# EAGLE design HD_RF_korsel_2010_10_26 (EAGLE 5.04)
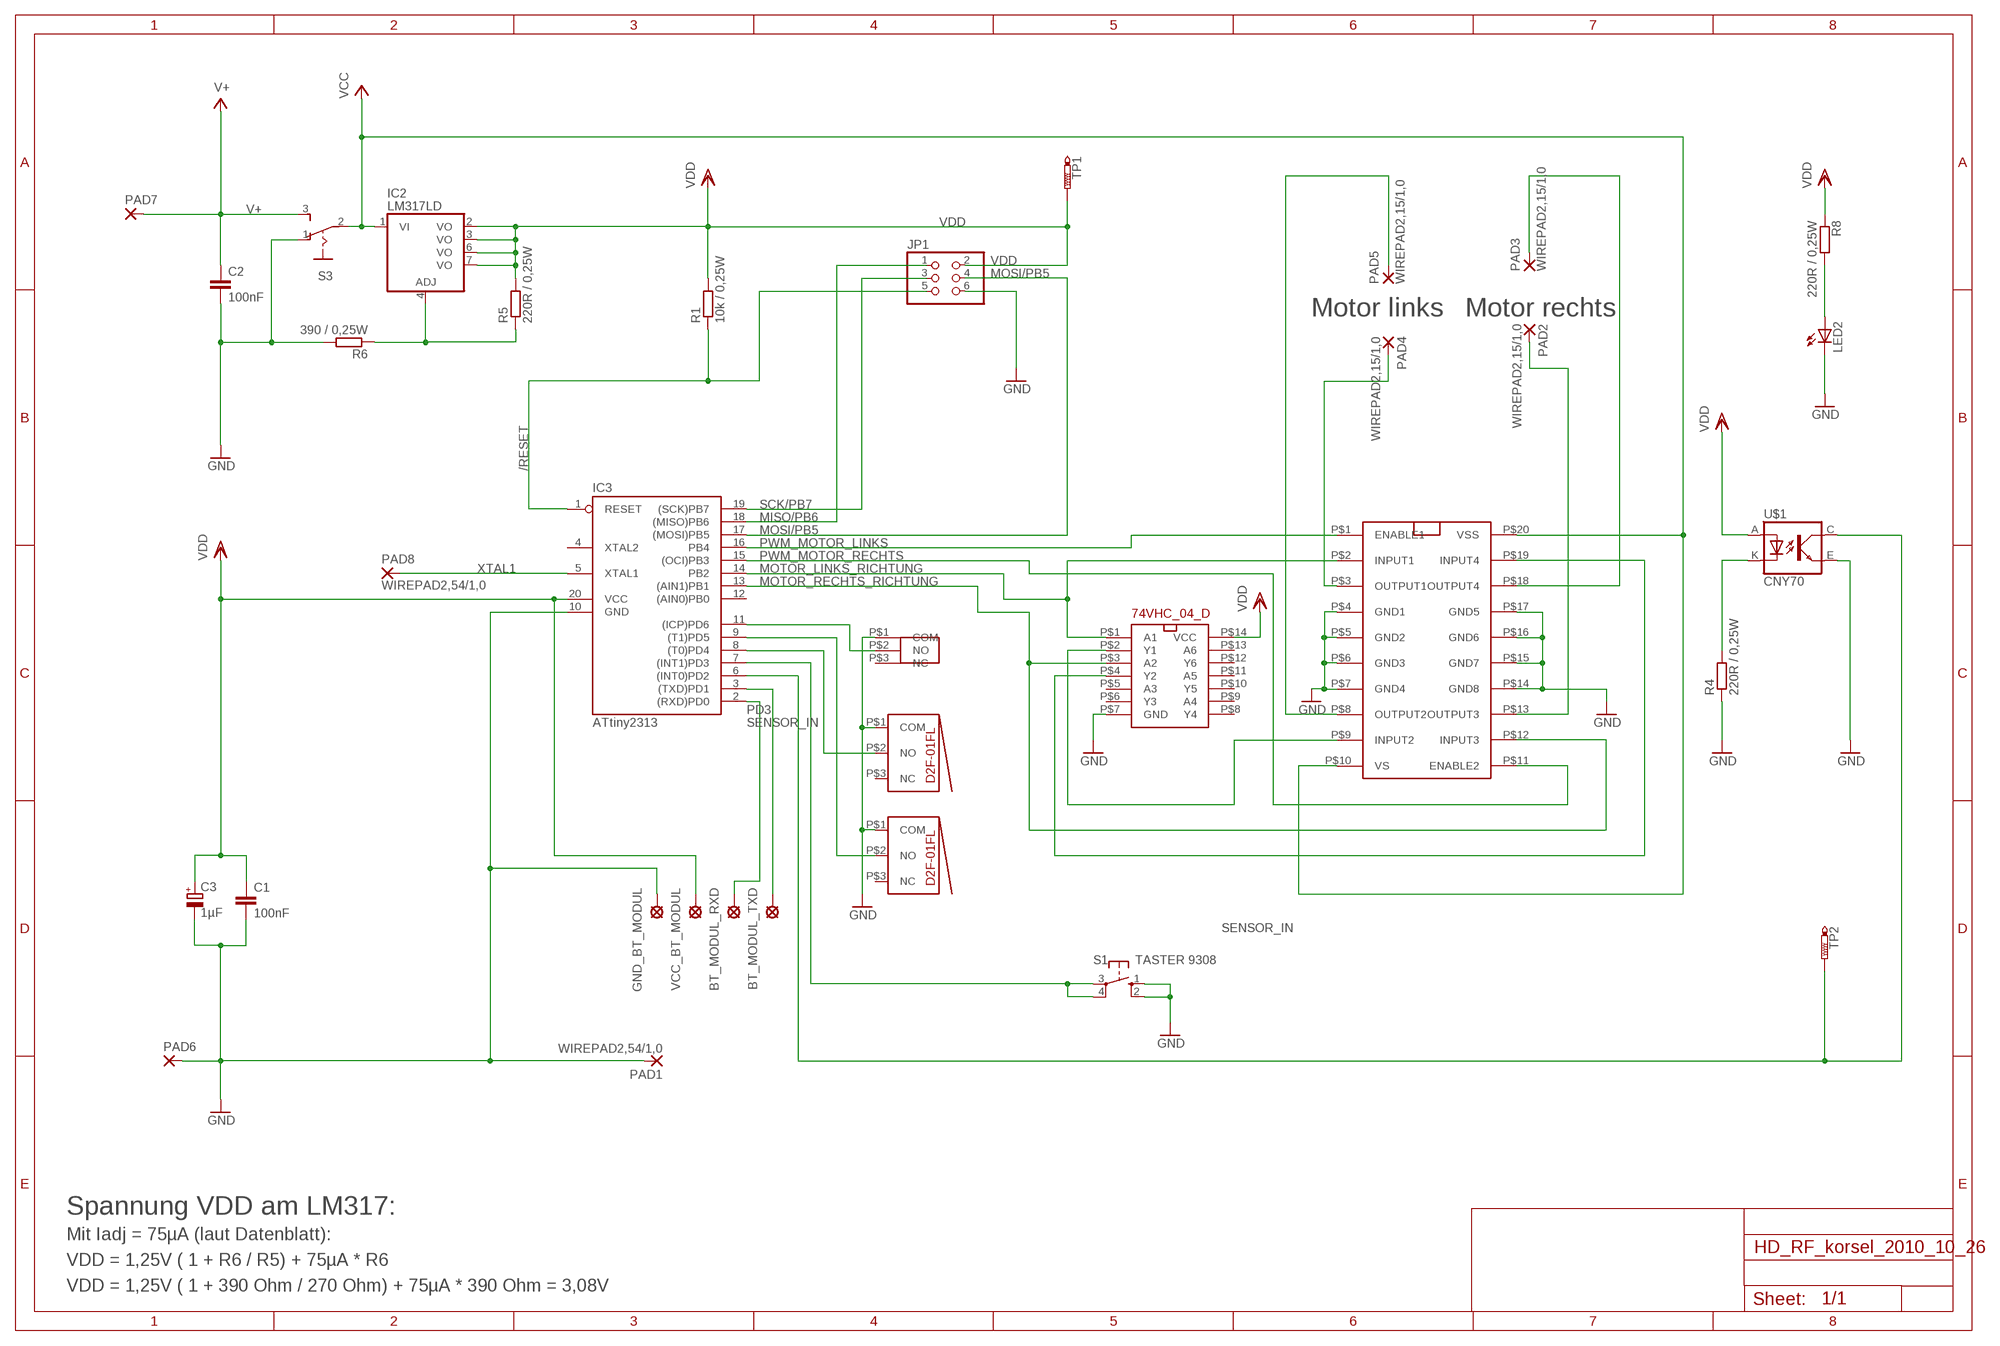
[diagram p0: schematic, sheet 1]

## Parts
BT_MODUL_RXD  LSP10  [LSP10]
BT_MODUL_TXD  LSP10  [LSP10]
C1  100nF  C-EUC1206  [C1206]
C2  100nF  C-EUC1206  [C1206]
C3  1µF  CPOL-EUSMCB  [SMC_B]
FRONT_SWITCH  DF-01FL_STEHEND  [DF-01FL_STEHEND]
GND_BT_MODUL  LSP10  [LSP10]
IC2  LM317LD  [SO08]
IC3  ATtiny2313  AT90S2313S  [SO20L]
JP1  PINHD-2X3  [2X03]
L293DD  L293DD  [L293DD]
LED2  LED3MM  [LED3MM]
LEFT_SWITCH  D2F-01FL  [D2F-01FL]
PAD1  WIREPAD2,54/1,0  [2,54/1,0]
PAD2  WIREPAD2,15/1,0  [2,15/1,0]
PAD3  WIREPAD2,15/1,0  [2,15/1,0]
PAD4  WIREPAD2,15/1,0  [2,15/1,0]
PAD5  WIREPAD2,15/1,0  [2,15/1,0]
PAD6  SMD5  [SMD2,54-5,08]
PAD7  SMD5  [SMD2,54-5,08]
PAD8  WIREPAD2,54/1,0  [2,54/1,0]
R1  10k / 0,25W  R-EU_R1206  [R1206]
R4  220R / 0,25W  R-EU_R1206  [R1206]
R5  220R / 0,25W  R-EU_R1206  [R1206]
R6  390 / 0,25W  R-EU_R1206  [R1206]
R8  220R / 0,25W  R-EU_R1206  [R1206]
RIGHT_SWITCH  D2F-01FL  [D2F-01FL]
S1  TASTER 9308  10-XX  [B3F-10XX]
S3  255SB  [255SB]
TP1  PTR1TP15R  [TP15R]
TP2  PTR1TP15R  [TP15R]
U$1  CNY70  CNY70SMD  [SMD]
U$2  74VHC_04_D  [74VHC_04_D]
VCC_BT_MODUL  LSP10  [LSP10]

## Nets
/RESET: IC3.1(RESET) JP1.5 R1.1
GND: C1.2 C2.2 C3.- FRONT_SWITCH.P$1(COM) GND_BT_MODUL.MP IC3.10(GND) JP1.6 L293DD.P$4(GND1) L293DD.P$5(GND2) L293DD.P$6(GND3) L293DD.P$7(GND4) L293DD.P$14(GND8) L293DD.P$15(GND7) L293DD.P$16(GND6) L293DD.P$17(GND5) LED2.K(C) LEFT_SWITCH.P$1(COM) PAD1.1(P) PAD6.1(P) R4.1 R6.2 RIGHT_SWITCH.P$1(COM) S1.1(S) S1.2(S1) S3.1(O) U$1.E(EMI) U$2.P$7(GND)
MISO/PB6: IC3.18((MISO)PB6) JP1.1
MOSI/PB5: IC3.17((MOSI)PB5) JP1.4
MOTOR_LINKS_RICHTUNG: IC3.14(PB2) L293DD.P$2(INPUT1) U$2.P$1(A1)
MOTOR_RECHTS_RICHTUNG: IC3.13((AIN1)PB1) L293DD.P$12(INPUT3) U$2.P$3(A2)
N$1: LED2.A R8.2
N$2: L293DD.P$3(OUTPUT1) PAD4.1(P)
N$3: R4.2 U$1.K(C)
N$4: L293DD.P$8(OUTPUT2) PAD5.1(P)
N$5: L293DD.P$13(OUTPUT3) PAD2.1(P)
N$6: BT_MODUL_RXD.MP IC3.2((RXD)PD0)
N$7: L293DD.P$18(OUTPUT4) PAD3.1(P)
N$8: BT_MODUL_TXD.MP IC3.3((TXD)PD1)
N$9: IC2.4(ADJ) R5.1 R6.1
N$14: L293DD.P$9(INPUT2) U$2.P$2(Y1)
N$15: L293DD.P$19(INPUT4) U$2.P$4(Y2)
N$16: FRONT_SWITCH.P$2(NO) IC3.11((ICP)PD6)
N$17: IC3.9((T1)PD5) RIGHT_SWITCH.P$2(NO)
N$18: IC3.8((T0)PD4) LEFT_SWITCH.P$2(NO)
PD3: IC3.7((INT1)PD3) S1.3(P) S1.4(P1)
PWM_MOTOR_LINKS: IC3.16(PB4) L293DD.P$1(ENABLE1)
PWM_MOTOR_RECHTS: IC3.15((OCI)PB3) L293DD.P$11(ENABLE2)
SCK/PB7: IC3.19((SCK)PB7) JP1.3
SENSOR_IN: IC3.6((INT0)PD2) TP2.TP U$1.C(COL)
V+: C2.1 PAD7.1(P) S3.3(S)
VCC: IC2.1(VI) L293DD.P$10(VS) L293DD.P$20(VSS) S3.2(P)
VDD: C1.1 C3.+ IC2.2(VO) IC2.3(VO) IC2.6(VO) IC2.7(VO) IC3.20(VCC) JP1.2 R1.2 R5.2 R8.1 TP1.TP U$1.A U$2.P$14(VCC) VCC_BT_MODUL.MP
XTAL1: IC3.5(XTAL1) PAD8.1(P)
Unconnected: FRONT_SWITCH.P$3(NC) IC3.4(XTAL2) IC3.12((AIN0)PB0) LEFT_SWITCH.P$3(NC) RIGHT_SWITCH.P$3(NC) U$2.P$5(A3) U$2.P$6(Y3) U$2.P$8(Y4) U$2.P$9(A4) U$2.P$10(Y5) U$2.P$11(A5) U$2.P$12(Y6) U$2.P$13(A6)

## Notes on the sheet
- Motor links | Motor rechts
- Spannung VDD am LM317:
- Mit Iadj = 75µA (laut Datenblatt):
- VDD = 1,25V ( 1 + R6 / R5) + 75µA * R6
- VDD = 1,25V ( 1 + 390 Ohm / 270 Ohm) + 75µA * 390 Ohm = 3,08V

## Library data of the parts
BT_MODUL_RXD BT_MODUL_TXD GND_BT_MODUL VCC_BT_MODUL = solpad:LSP10: SOLDER PAD drill 1.0 mm, distributor Buerklin, 12H555
C1 C2 = rcl:C-EU: CAPACITOR, European symbol
C3 = rcl:CPOL-EU: POLARIZED CAPACITOR, European symbol
FRONT_SWITCH = DF-01FL_stehend:DF-01FL_STEHEND
IC2 = linear:LM317LD: LOW CURRENT 1.2 TO 37V ADJUSTABLE VOLTAGE REGULATOR Source: http://pdf.alldatasheet.com
IC3 = atmel:AT90S2313: MICROCONTROLLER 2 Kbytes FLASH 128 bytes SRAM 128 bytes EEPROM UART
JP1 = pinhead:PINHD-2X3: PIN HEADER
L293DD = l293DD:L293DD
LED2 = led:LED: LED OSRAM: - CHIPLED LG R971, LG N971, LY N971, LG Q971, LY Q971, LO R971, LY R971 LH N974, LH R974 LS Q976, LO Q976, LY Q976 LO Q996 - Hyper CHIPLED LW Q18S LB Q993, LB Q99A, LB R99A - SideLED LS A670, LO A670, LY A670, LG A670, LP A670 LB A673, LV A673, LT A673, LW A673 LH A674 LY A675 LS A676, LA A676, LO A676, LY A676, LW A676 LS A679, LY A679, LG A679 - Hyper Micro SIDELED® LS Y876, LA Y876, LO Y876, LY Y876 LT Y87S - SmartLED LW L88C, LW L88S LB L89C, LB L89S, LG L890 LS L89K, LO L89K, LY L89K LS L896, LA L896, LO L896, LY L896 - TOPLED LS T670, LO T670, LY T670, LG T670, LP T670 LSG T670, LSP T670, LSY T670, LOP T670, LYG T670 LG T671, LOG T671, LSG T671 LB T673, LV T673, LT T673, LW T673 LH T674 LS T676, LA T676, LO T676, LY T676, LB T676, LH T676, LSB T676, LW T676 LB T67C, LV T67C, LT T67C, LS T67K, LO T67K, LY T67K, LW E67C LS E67B, LA E67B, LO E67B, LY E67B, LB E67C, LV E67C, LT E67C LW T67C LS T679, LY T679, LG T679 LS T770, LO T770, LY T770, LG T770, LP T770 LB T773, LV T773, LT T773, LW T773 LH T774 LS E675, LA E675, LY E675, LS T675 LS T776, LA T776, LO T776, LY T776, LB T776 LHGB T686 LT T68C, LB T68C - Hyper Mini TOPLED® LB M676 - Mini TOPLED Santana® LG M470 LS M47K, LO M47K, LY M47K Source: http://www.osram.convergy.de LUXEON: - LUMILED® LXK2-PW12-R00, LXK2-PW12-S00, LXK2-PW14-U00, LXK2-PW14-V00 LXK2-PM12-R00, LXK2-PM12-S00, LXK2-PM14-U00 LXK2-PE12-Q00, LXK2-PE12-R00, LXK2-PE12-S00, LXK2-PE14-T00, LXK2-PE14-U00 LXK2-PB12-K00, LXK2-PB12-L00, LXK2-PB12-M00, LXK2-PB14-N00, LXK2-PB14-P00, LXK2-PB14-Q00 LXK2-PR12-L00, LXK2-PR12-M00, LXK2-PR14-Q00, LXK2-PR14-R00 LXK2-PD12-Q00, LXK2-PD12-R00, LXK2-PD12-S00 LXK2-PH12-R00, LXK2-PH12-S00 LXK2-PL12-P00, LXK2-PL12-Q00, LXK2-PL12-R00 Source: www.luxeon.com KINGBRIGHT: KA-3528ASYC Source: www.kingbright.com
LEFT_SWITCH RIGHT_SWITCH = D2F-01FL:D2F-01FL
PAD1-PAD5 PAD8 = wirepad:WIREPAD: Wire PAD connect wire on PCB
PAD6 PAD7 = wirepad:SMD5: SMD PAD
R1 R4-R6 R8 = rcl:R-EU_: RESISTOR, European symbol
S1 = switch-omron:10-XX: OMRON SWITCH
S3 = switch:255SB: SLIDING SWITCH Distributor Buerklin, 11G810
TP1 TP2 = testpad:PTR1: TEST PIN
U$1 = cny70:CNY70
U$2 = 74VHC_04_D:74VHC_04_D

## Board
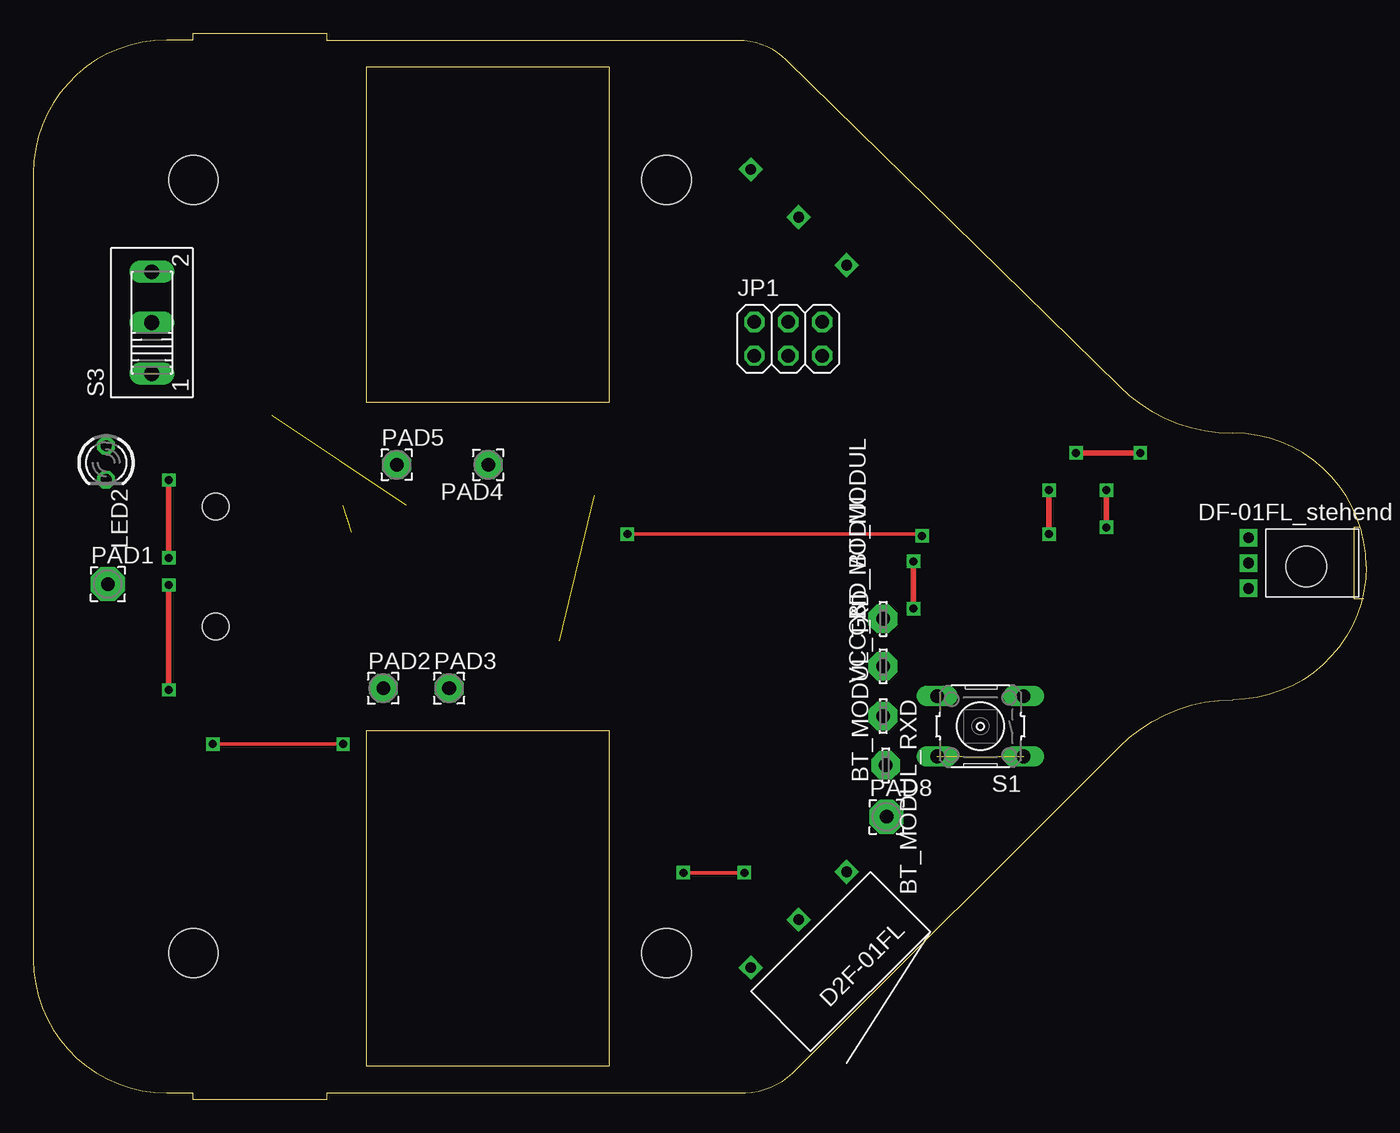
[diagram p1: board, top side]
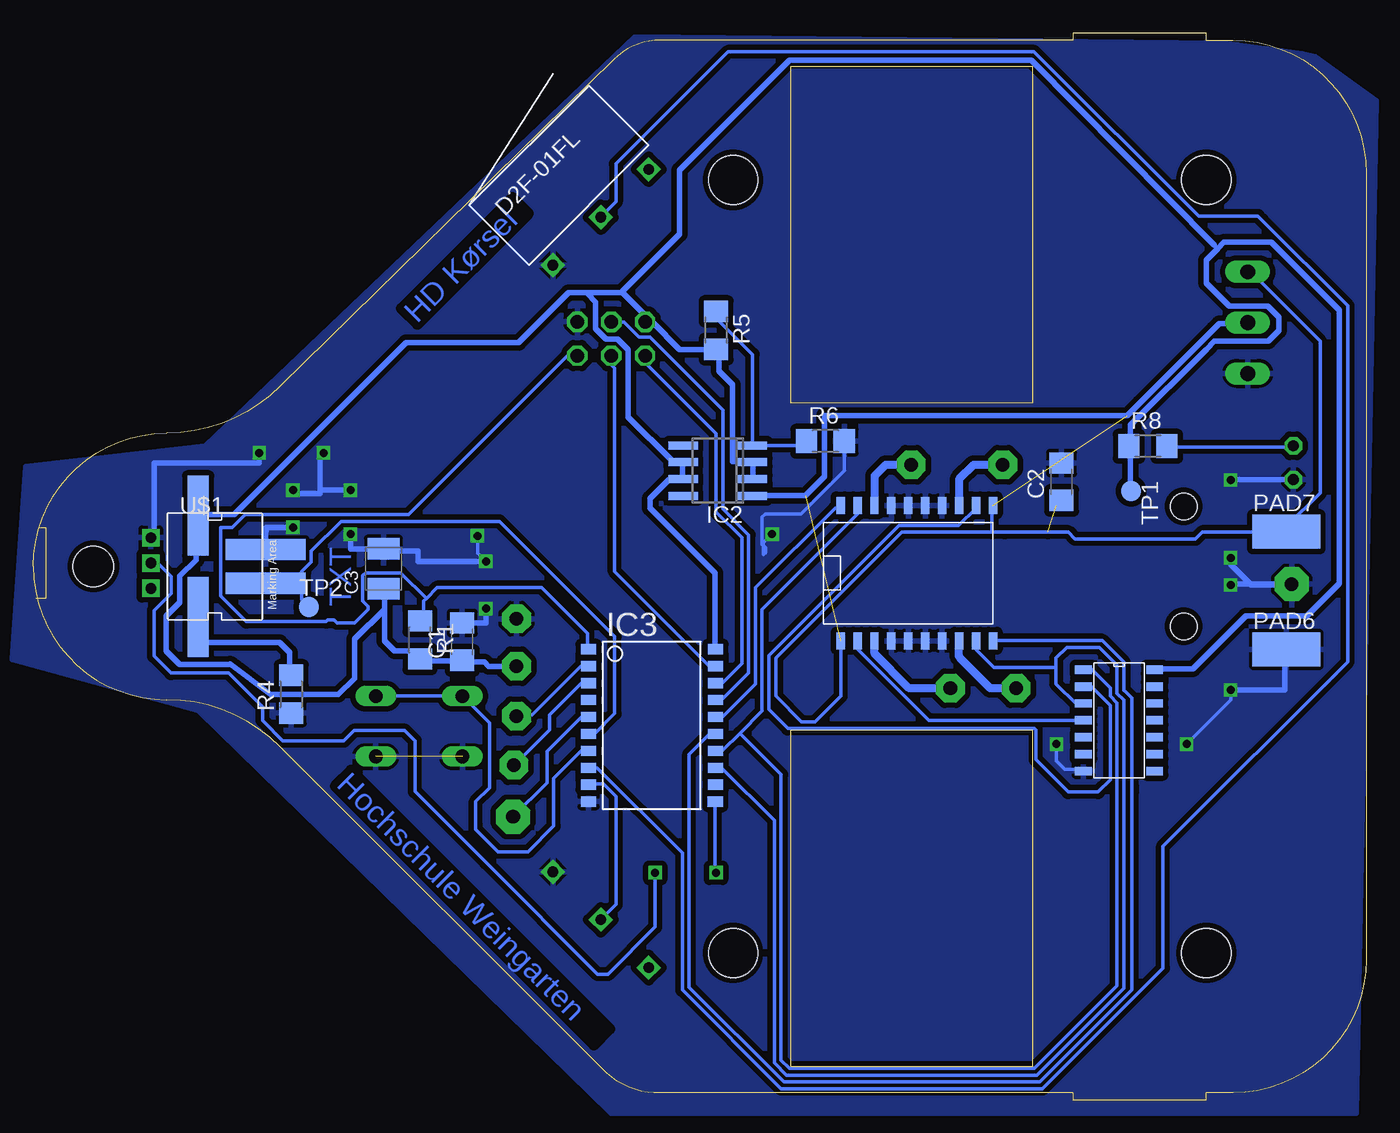
[diagram p2: board, bottom side, seen from below]

Size 100 x 80 mm. Coordinates in mm from the lower left corner, seen from the top.
Outline: 99.57,42.93 99.06,42.93 99.06,37.59 99.82,37.59
Outline: 25,77.5 43.2,77.5 43.2,52.3 25,52.3 25,77.5
Outline: 25,27.7 43.2,27.7 43.2,2.5 25,2.5 25,27.7
Outline: 100,40 arc-90 90,30 arc45 81.47,26.46 56.97,1.96 arc-45 52.93,0.5 22,0.5 22,0 12,0 12,0.5 10,0.5 arc-90 0,10.5 0,69.5 arc-90 10,79.5 12,79.5 12,80 22,80 22,79.5 52.93,79.5 arc-45 56.47,78.03 81.47,53.53 arc45 90,50 arc-90 100,40
Copper layers (1*16): Top 0.035mm / dielectric 1.5mm / Bottom 0.035mm
Design rules "default *": minimum track width 10mil, minimum drill 4mil, track to track 8mil, track to pad 8mil, pad to pad 8mil, via to via 8mil, smd to smd 8mil, copper to edge 0mil, drill to drill 8mil, minimum pad ring 10mil, minimum via ring 8mil, stop-mask expansion 4mil, vias tented up to drill 0mil, thermal gap 10mil
Holes 3.7 mm at 12,11 12,69 47.5,69 47.5,11
Holes 3.05 mm at 95.5,40
Holes 2 mm at 13.68,44.5 13.68,35.5
bKeepout: area 92.2,36.7 to 98.8,43.3

### Footprints (pad centres in the part's own frame; a part is rotated, then mirrored left to right if it is on the bottom)
LSP10 = drill 1.016 pad 2.159 octagon: MP 0,0
C1206 = smd 1.6 x 1.8: 1 -1.4,0; 2 1.4,0
SMC_B = smd 1.6 x 2.4: + -1.5,0; - 1.5,0
DF-01FL_STEHEND = drill 0.8 square: P$1 -1.905,-2.54; P$2 0,-2.54; P$3 1.905,-2.54
SO08 = smd 0.6 x 2.2: 1 -1.905,-2.6; 2 -0.635,-2.6; 3 0.635,-2.6; 4 1.905,-2.6; 5 1.905,2.6; 6 0.635,2.6; 7 -0.635,2.6; 8 -1.905,2.6
SO20L = smd 0.762 x 1.143: 1 -5.08,-5.131; 2 -3.81,-5.131; 3 -2.54,-5.131; 4 -1.27,-5.131; 5 0,-5.131; 6 1.27,-5.131; 7 2.54,-5.131; 8 3.81,-5.131; 9 5.08,-5.131; 10 6.35,-5.131; 11 6.35,4.369; 12 5.08,4.394; 13 3.81,4.394; 14 2.54,4.394; 15 1.27,4.394; 16 0,4.394; 17 -1.27,4.394; 18 -2.54,4.394; 19 -3.81,4.394; 20 -5.08,4.394
2X03 = drill 1.016 octagon: 1 -2.54,-1.27; 2 -2.54,1.27; 3 0,-1.27; 4 0,1.27; 5 2.54,-1.27; 6 2.54,1.27
L293DD = smd 1.27 x 0.635 bottom: P$1 -1.27,-1.27; P$2 -1.27,-2.54; P$3 -1.27,-3.81; P$4 -1.27,-5.08; P$5 -1.27,-6.35; P$6 -1.27,-7.62; P$7 -1.27,-8.89; P$8 -1.27,-10.16; P$9 -1.27,-11.43; P$10 -1.27,-12.7; P$11 8.89,-12.7; P$12 8.89,-11.43; P$13 8.89,-10.16; P$14 8.89,-8.89; P$15 8.89,-7.62; P$16 8.89,-6.35; P$17 8.89,-5.08; P$18 8.89,-3.81; P$19 8.89,-2.54; P$20 8.89,-1.27
LED3MM = drill 0.813 octagon: A -1.27,0; K 1.27,0
D2F-01FL = drill 0.8 square: P$1 -3.81,-5.08; P$2 1.27,-5.08; P$3 6.35,-5.08
2,54/1,0 = drill 1.016 pad 2.54 octagon: 1 0,0
2,15/1,0 = drill 1.016 pad 2.159 octagon: 1 0,0
SMD2,54-5,08 = smd 2.54 x 5.08: 1 0,0
R1206 = smd 1.6 x 1.803: 1 -1.422,0; 2 1.422,0
B3F-10XX = drill 1.016 long: 1 -3.251,2.261; 2 3.251,2.261; 3 -3.251,-2.261; 4 3.251,-2.261
255SB = drill 1.118 long: 1 -3.81,0; 2 0,0; 3 3.81,0
TP15R = smd 1.5 x 1.5: TP 0,0
SMD = smd 1.6 x 6: A -1.27,3.81; K -1.27,-3.81 | smd 6 x 1.6: C 3.81,-1.27; E 3.81,1.27
74VHC_04_D = smd 0.635 x 1.27: P$1 8.128,0.762; P$2 6.858,0.762; P$3 5.588,0.762; P$4 4.318,0.762; P$5 3.048,0.762; P$6 1.778,0.762; P$7 0.508,0.762; P$8 0.508,-4.572; P$9 1.778,-4.572; P$10 3.048,-4.572; P$11 4.318,-4.572; P$12 5.588,-4.572; P$13 6.858,-4.572; P$14 8.128,-4.572

### Placement (x,y rotation side)
BT_MODUL_RXD  63.75,28.77 270 top
BT_MODUL_TXD  63.94,25.08 90 top
C1  67.82,34.35 90 bottom
C2  22.86,46.35 90 bottom
C3  73.72,39.81 90 bottom
FRONT_SWITCH  93.73,40.25 270 top
GND_BT_MODUL  63.75,36.07 90 top
IC2  48.64,47.18 90 bottom
IC3  53.21,28.7 270 bottom
JP1  56.64,57.09 0 top
L293DD  40.7,43.31 270 top
LED2  5.46,47.78 270 top
LEFT_SWITCH  61.91,68.9 45 bottom
PAD1  5.59,38.67 0 top
PAD2  26.26,30.86 0 top
PAD3  31.19,30.86 0 top
PAD4  34.13,47.62 180 top
PAD5  27.26,47.62 0 top
PAD6  6,33.77 270 bottom
PAD7  6,42.61 270 bottom
PAD8  64.01,21.21 0 top
R1  70.99,34.48 270 bottom
R4  80.64,30.42 90 bottom
R5  48.77,57.72 270 bottom
R6  40.58,49.4 0 bottom
R8  16.38,49.02 0 bottom
RIGHT_SWITCH  61.91,10.79 225 top
S1  71.06,28 180 top
S3  8.89,58.29 90 top
TP1  17.65,45.66 270 bottom
TP2  79.31,36.96 0 bottom
U$1  86.36,40 0 bottom
U$2  20.45,24.13 90 bottom
VCC_BT_MODUL  63.75,32.51 90 top

### Tracks (layer width: path | path; a pad name or v marks a point on that pad's centre or on a via)
/RESET
  Bottom 0.254: 70.51,37.59 70.71,37.39 70.71,35.97 70.81,35.87 70.92,35.87 R1.1 | 70.51,37.59 69.7,38.41 61.87,38.41 58.42,34.95 58.42,33.83 IC3.1 | 70.51,37.59 72.44,39.52 75.08,39.52 75.29,39.32 75.29,37.39 74.88,36.98 74.88,36.78 75.89,35.76 77.22,35.76 77.42,35.97 77.93,35.97 78.03,35.87 84.02,35.87 85.95,37.8 85.95,38.81 85.95,39.9 85.95,40.21 85.95,40.79 85.95,42.93 85.09,42.93 84.68,43.33 84.12,43.89 71.83,43.89 59.94,55.78 59.23,55.78 JP1.5
GND  (via drill 0.6)  (1 unrouted)
  Top 0.254: v13.46,26.67 v23.24,26.67 | v44.58,42.42 66.55,42.42 v66.67,42.29
  Top 0.406: v78.23,48.51 v83.06,48.51 | v80.52,45.72 v80.52,42.93 | v66.04,40.39 v66.04,36.83 | v76.2,42.42 v76.2,45.72 | v10.16,30.73 v10.16,38.61 | v10.16,40.64 v10.16,46.48
  Bottom 0.254: U$2.P$7 21.34,24.77 22.61,24.77 23.24,25.4 v23.24,26.67 | v13.46,26.67 10.16,29.97 v10.16,30.73 | R6.2 39.15,47.21 42.42,43.94 45.09,43.94 45.34,43.69 45.34,41.66 45.09,41.4 45.09,41.02 45.21,40.89 45.21,41.78 v44.58,42.42 | v66.67,42.29 66.67,41.02 v66.04,40.39
  Bottom 0.406: FRONT_SWITCH.P$1 90.93,42.16 90.93,47.75 83.06,47.75 v83.06,48.51 | v78.23,48.51 78.49,48.51 78.49,45.97 | 78.49,45.97 78.49,45.47 80.52,45.47 v80.52,45.72 | v80.52,42.93 82.55,42.93 82.55,42.67 82.56,42.67 U$1.E | C1.2 66.04,35.75 v66.04,36.83 | v66.04,40.39 71.12,40.39 71.12,41.15 73.72,41.15 C3.- 76.2,41.31 v76.2,42.42 | v76.2,45.72 78.49,45.72 78.49,45.97 | PAD6.1 6.1,33.67 6.1,30.73 v10.16,30.73 | v10.16,38.61 10.1,38.67 PAD1.1 5.65,38.61 8.64,38.61 10.16,40.13 v10.16,40.64 | v10.16,46.48 10.13,46.51 LED2.K
  pour Bottom (isolate 0.406): 10.67,79.25 54.86,79.76 87.12,49.02 100.58,47.5 101.6,33.02 87.63,29.21 56.64,-1.02 0.76,-1.02 -0.76,74.93 3.81,78.23 4.83,78.49
MISO/PB6
  Bottom 0.254: IC3.18 48.77,31.29 48.26,31.29 46.84,32.72 46.84,42.16 48.77,44.09 48.77,49.99 54.05,55.27 54.05,55.78 JP1.1
MOSI/PB5
  Bottom 0.254: IC3.17 48.77,29.97 48.36,29.97 46.33,32 46.33,42.37 48.26,44.3 48.26,51.71 53.75,57.2 54.56,57.2 55.68,58.32 56.59,58.32 JP1.4
MOTOR_LINKS_RICHTUNG
  Bottom 0.254: 46.99,27.48 45.31,29.16 45.31,36.78 38.1,43.99 38.1,44.5 L293DD.P$2 | 46.99,27.48 48.26,26.21 48.77,26.21 IC3.14 | U$2.P$1 21.13,32.31 20.62,32.31 19.2,30.89 19.2,30.28 18.69,29.77 18.69,8.53 24.89,2.34 43.28,2.34 43.89,2.95 43.89,24.38 46.94,27.43 46.99,27.48
MOTOR_RECHTS_RICHTUNG
  Bottom 0.254: 23.27,32.41 23.27,31.19 21.74,29.67 21.23,29.67 U$2.P$3 | 23.27,32.41 23.27,33.12 22.45,33.93 20.02,33.93 18.69,32.61 18.69,30.48 18.19,29.97 18.19,8.33 24.69,1.83 43.48,1.83 44.4,2.74 44.4,20.93 48.36,24.89 48.77,24.89 IC3.13 | L293DD.P$12 29.26,34.34 29.26,33.73 27.94,32.41 23.37,32.41 23.27,32.41
N$1
  Bottom 0.254: R8.2 14.94,48.97 5.49,48.97 LED2.A
N$2
  Bottom 0.61: PAD4.1 36.07,47.62 36.89,46.8 L293DD.P$3
N$3
  Bottom 0.406: R4.2 80.77,31.84 80.77,33.53 81.53,34.29 87.63,34.29 U$1.K
N$4
  Bottom 0.61: PAD5.1 29.46,47.62 30.54,46.55 L293DD.P$8
N$5
  Bottom 0.254: 30.48,33.15 30.54,33.21
  Bottom 0.61: PAD2.1 28.19,30.86 30.48,33.15 | 30.54,33.21 L293DD.P$13
N$6
  Bottom 0.254: IC3.2 58.42,32.51 58.93,32.51 62.59,28.85 63.7,28.85 BT_MODUL_RXD.MP
N$7
  Bottom 0.61: PAD3.1 34.29,30.86 36.89,33.47 L293DD.P$18
N$8
  Bottom 0.254: IC3.3 58.42,31.29 58.83,31.29 61.27,28.85 61.27,27.74 63.91,25.09 BT_MODUL_TXD.MP
N$9
  Bottom 0.254: R5.1 48.77,59.23 48.56,59.03 48.56,58.42 46.53,56.39 46.04,55.9 IC2.4 42.32,49.09 R6.1
N$14
  Bottom 0.254: U$2.P$2 21.13,30.99 20.62,30.99 19.2,29.57 19.2,23.98 20.12,23.06 22.35,23.06 24.79,25.5 24.79,27.74 24.89,27.84 43.38,27.84 44.81,29.26 44.81,33.33 35.05,43.08 30.58,43.08 29.26,44.4 29.26,44.5 L293DD.P$9
N$15
  Bottom 0.254: U$2.P$4 21.23,28.45 25.6,28.45 25.65,28.45 32.82,28.45 38.2,33.83 38.2,34.34 L293DD.P$19
N$16  (via drill 0.6)
  Top 0.254: v48.77,17.02 v53.34,17.02
  Bottom 0.254: v53.34,17.02 53.34,12.95 56.9,9.4 57.66,9.4 66.04,17.78 71.37,23.11 71.37,26.92 72.14,27.69 75.95,27.69 76.71,26.92 81.28,26.92 82.8,28.45 82.8,29.46 84.58,31.24 85.34,32 89.66,32 90.93,33.27 90.93,36.7 89.66,37.97 89.66,39.24 90.67,40.25 FRONT_SWITCH.P$2 | 48.84,17.09 IC3.11
  Bottom 0.406: v48.77,17.02 48.84,17.09
N$17
  Bottom 0.254: IC3.9 58.32,23.67 57.2,23.67 56.29,22.76 56.29,14.63 57.4,13.51 RIGHT_SWITCH.P$2
N$18
  Bottom 0.254: IC3.8 58.32,24.89 57.71,24.89 51.31,18.49 51.31,8.23 43.89,0.81 24.28,0.81 15.24,9.86 15.24,19 1.4,32.84 1.4,59.56 7.82,65.99 8.13,66.29 12.55,66.29 12.57,66.27 24.92,78.61 47.88,78.61 56.29,70.21 56.29,67.36 57.4,66.24 LEFT_SWITCH.P$2
PD3
  Bottom 0.254: IC3.7 58.42,26.21 58.83,26.21 60.96,24.08 60.96,20.52 62.89,18.59 65.13,18.59 66.8,20.27 66.8,20.57 66.8,22.35 65.79,23.37 65.79,28.25 S1.4 S1.3
PWM_MOTOR_LINKS
  Bottom 0.254: IC3.16 48.77,28.75 48.26,28.75 45.82,31.19 45.82,38.41 39.83,44.4 39.42,44.4 39.42,44.5 L293DD.P$1
PWM_MOTOR_RECHTS
  Bottom 0.254: 17.58,23.09 17.58,8.23 24.49,1.32 43.69,1.32 50.8,8.43 50.8,25.91 49.28,27.43 48.87,27.43 IC3.15 | 17.58,23.09 17.58,23.47 | L293DD.P$11 27.94,34.44 19.81,34.44 18.19,32.82 18.19,30.68 18.14,30.68 17.58,30.12 17.58,23.09
SCK/PB7
  Bottom 0.254: IC3.19 48.87,32.51 49.28,32.51 56.39,39.62 56.39,54.86 56.69,55.17 56.69,55.78 JP1.3
SENSOR_IN
  Bottom 0.254: IC3.6 58.32,27.43 57.91,27.43 56.39,28.96 56.39,34.75 65.02,43.38 76.91,43.38 79.15,41.15 79.15,40.34 79.86,39.62 79.86,39.12 79.88,39.09 79.88,38.71 | 79.88,38.71 82.5,38.71 U$1.C | TP2.TP 79.88,37.53 79.88,38.71
V+  (1 unrouted)
  Bottom 0.254: S3.3 8.84,62.08 8.64,62.08 3.45,56.9 3.45,45.52 5.99,42.98 5.99,42.67 PAD7.1 6.1,42.57 12.29,42.57 12.8,42.06 21.84,42.06 22.35,42.57 23.88,42.57 27.13,42.57 28.07,42.57 | 39.42,34.34 39.42,30.28 41.35,28.35 42.37,28.35 44.3,30.28 44.3,33.12 34.85,42.57 28.07,42.57 | 27.94,44.5 28.07,44.37 28.07,42.57 | C2.1 23.24,44.58
VCC  (2 unrouted)
  Bottom 0.254: 45.21,45.31 46.02,45.31 IC2.1 | S3.2 8.94,58.22
  Bottom 0.406: 45.21,45.31 42.06,45.31 40.64,46.74 40.64,51.31 39.37,51.31 17.93,51.31 16.99,52.25 11.43,57.81 11.02,58.22 8.94,58.22
VDD
  Bottom 0.254: 5.69,36.27 5.89,36.27 | 17.68,49.28 17.88,49.07 R8.1 17.88,48.97 17.68,48.77 | 15.85,32.31 U$2.P$14 | 17.68,45.72 TP1.TP | 70.71,32.92 70.92,33.12 R1.2 70.92,33.22 70.92,33.63 | 67.87,32.92 C1.1 67.77,33.02 67.56,32.82 | 73.66,38.3 C3.+ | 63.8,32.51 VCC_BT_MODUL.MP | 52.32,46.53 51.31,46.53 IC2.7 51.31,46.63 | 48.87,33.83 IC3.20 | 51.31,47.75 IC2.6 51.31,47.85 52.09,47.85 | 46.02,46.63 IC2.2 | 46.02,47.75 IC2.3 46.13,47.85 46.74,47.85 | 53.54,58.32 54.05,58.32 JP1.2 53.65,58.42 | 48.77,56.29 R5.2 48.67,56.29 48.56,56.29 | 87.58,43.89 U$1.A 87.68,43.69 87.68,43.59 87.78,43.48 | 58.42,60.55 58.42,60.45 | 73.66,36.78 73.66,36.88 | 11.33,63.65 11.38,63.7 | 55.78,60.66 55.78,60.55 | 85.27,32.64 85.24,32.66 | 90.04,33.66 90.04,33.78 90.02,33.81 | 11.38,64.11 11.38,64.08 11.14,63.84
  Bottom 0.406: 15.85,32.31 13.01,32.31 9.04,36.27 5.89,36.27 | 5.69,36.27 4.47,36.27 2.03,38.71 2.03,59.23 7.11,64.31 10.67,64.31 11.14,63.84 11.33,63.65 11.99,62.99 11.99,61.27 10.26,59.54 7.37,59.54 6.55,58.73 6.55,57.68 7.34,56.9 10.06,56.9 11.38,56.9 11.99,56.29 17.68,50.6 17.68,49.28 | 17.68,48.77 17.68,45.72 | 70.71,32.92 67.87,32.92 | 73.66,38.3 73.66,36.88 73.66,34.42 72.9,33.66 70.94,33.66 70.92,33.63 | 63.8,32.51 65.84,32.51 66.14,32.82 67.56,32.82 | 48.87,33.83 48.87,39.52 53.75,44.4 53.75,45.11 52.32,46.53 | 51.31,47.75 51.31,46.63 | 46.02,47.75 46.02,46.63 | 48.77,56.29 51.51,56.29 53.54,58.32 | 46.74,47.85 47.55,47.85 47.55,53.65 48.56,54.66 48.56,56.29 | 87.58,43.89 84.94,43.89 72.03,56.79 63.6,56.79 59.84,60.55 58.42,60.55 55.78,60.55 53.65,58.42 | 58.42,60.45 57.81,59.84 57.81,57.84 57.05,57.07 56.16,57.07 55.37,56.29 55.37,51.21 52.09,47.93 52.09,47.85 | 73.66,36.78 75.89,34.54 75.89,31.6 77.11,30.38 82.19,30.38 85.24,32.66 | 87.78,43.48 87.78,40.49 89,39.27 89,37.29 90.02,36.27 90.02,33.81 | 55.78,60.66 51.51,64.92 51.51,69.72 43.26,77.98 25.12,77.98 11.38,64.11 | 85.27,32.64 89.03,32.64 90.04,33.66
XTAL1
  Bottom 0.254: IC3.5 58.42,28.75 58.83,28.75 61.47,26.11 61.47,23.77 64.01,21.23 PAD8.1

### Text on the board
Bottom: HD Kørsel | TXT | Hochschule Weingarten
tDocu: EIN | AUS